# EAGLE design ProbeTK_r1.0 (EAGLE 5.00)
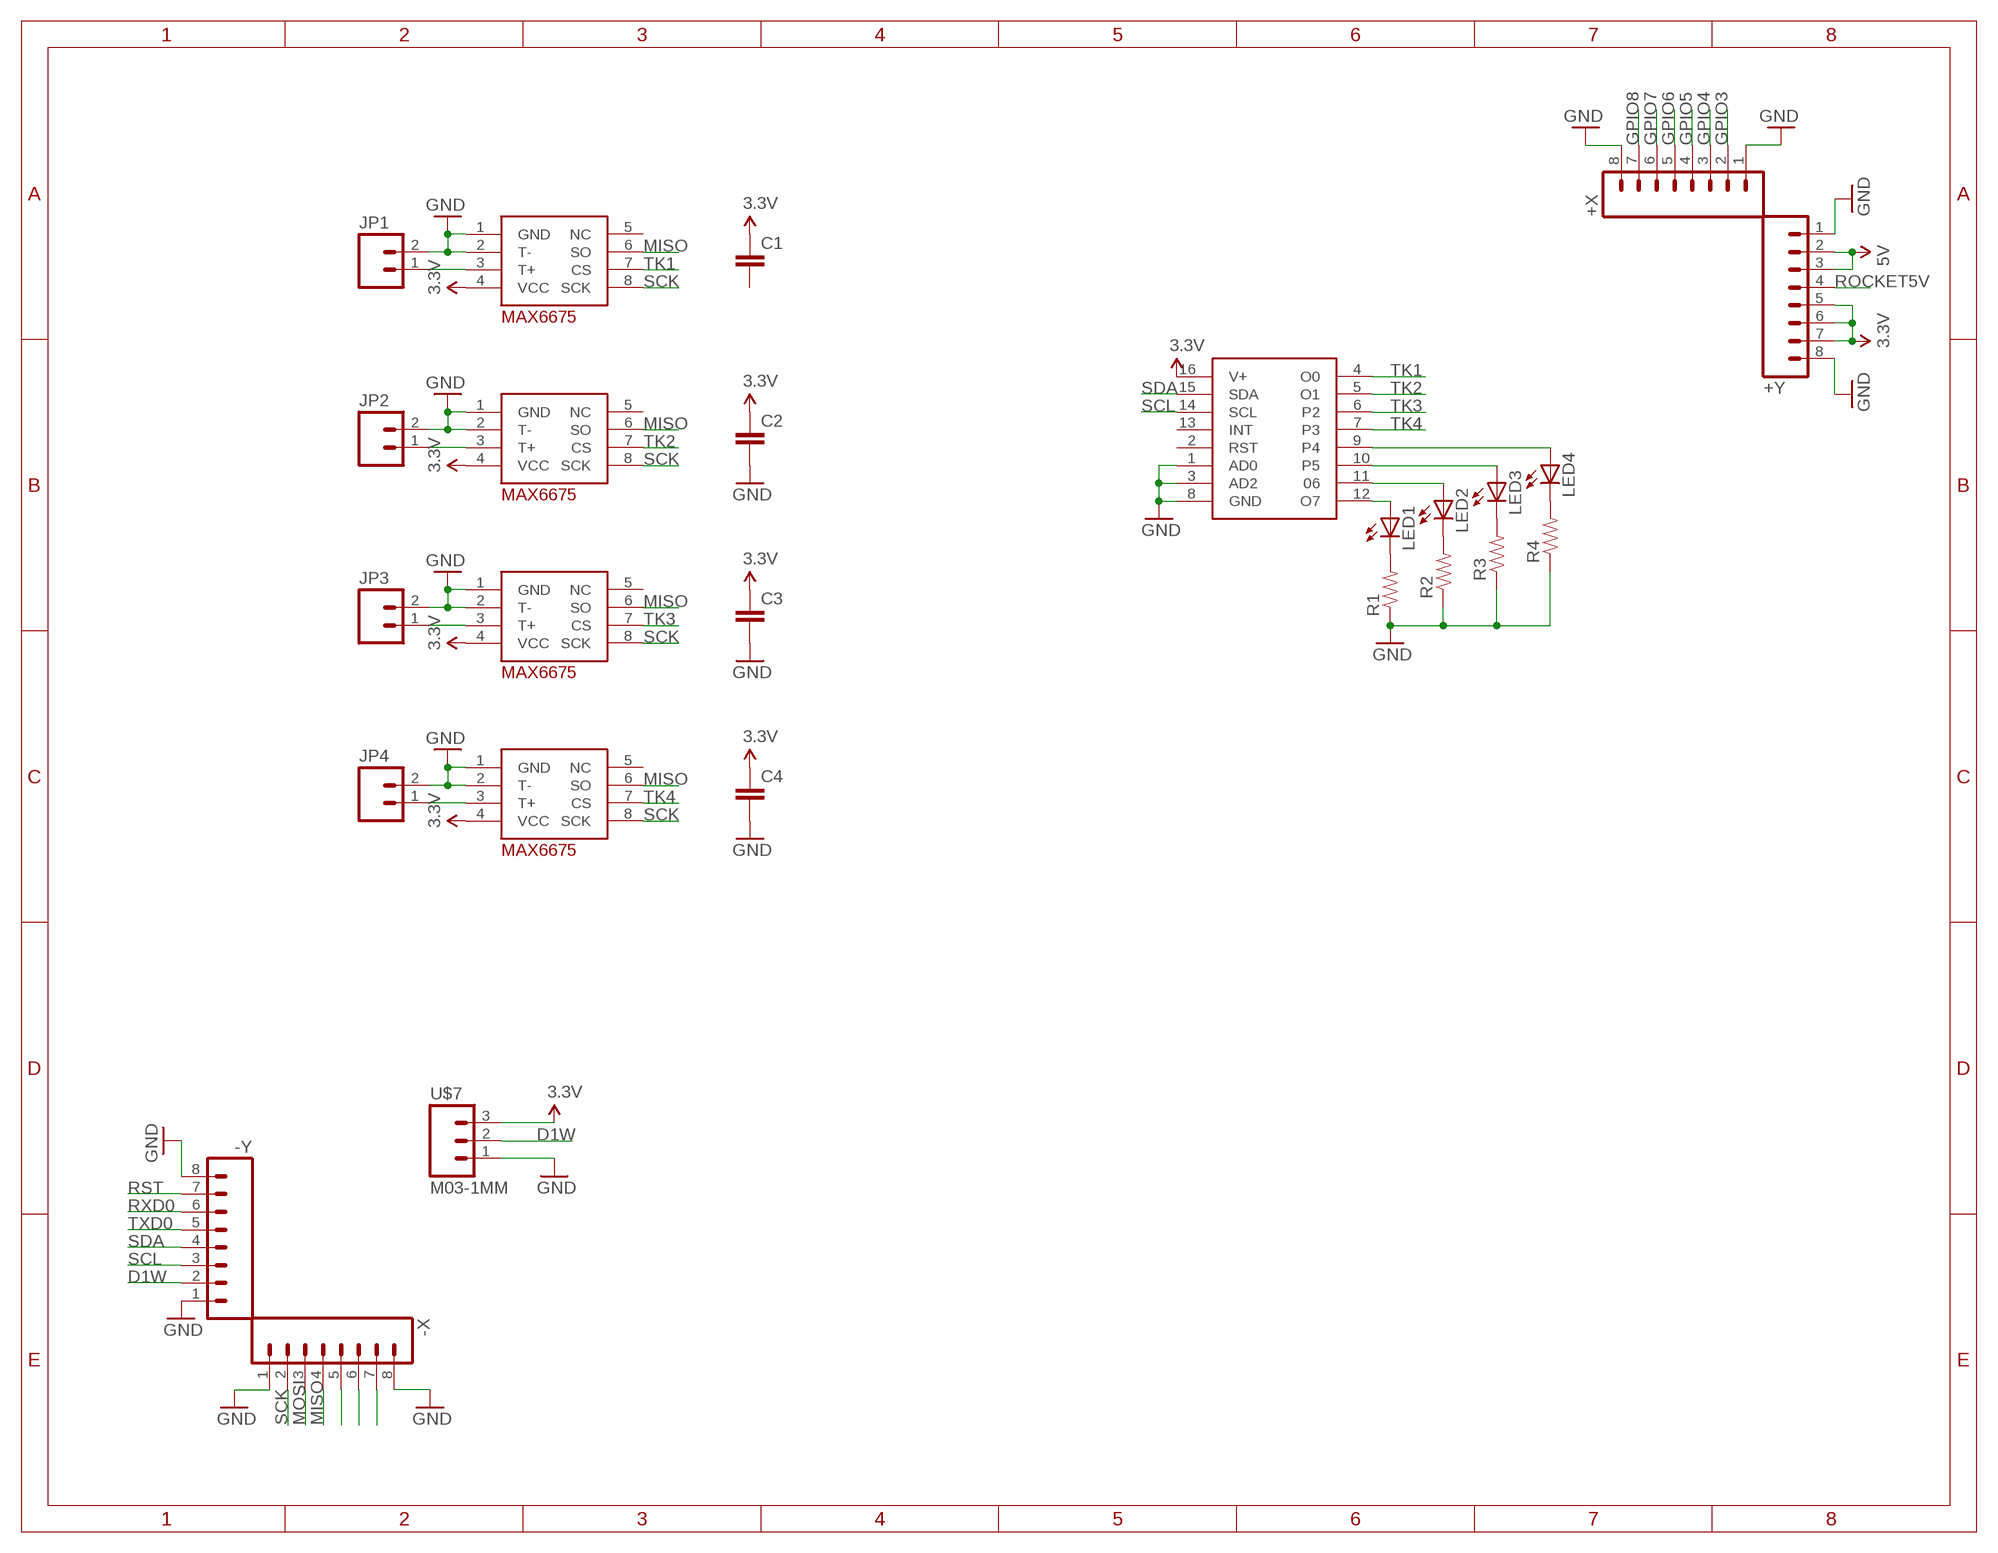
[diagram p0: schematic, sheet 1]

## Parts
+X  M08  [1X08]
+Y  M08  [1X08]
-X  M08  [1X08]
-Y  M08  [1X08]
C1  CAP0805  [0805]
C2  CAP0805  [0805]
C3  CAP0805  [0805]
C4  CAP0805  [0805]
JP1  M02-JST-2MM-SMT  [S2B-PH]
JP2  M02-JST-2MM-SMT  [S2B-PH]
JP3  M02-JST-2MM-SMT  [S2B-PH]
JP4  M02-JST-2MM-SMT  [S2B-PH]
LED1  LEDCHIPLED_0805  [CHIPLED_0805]
LED2  LEDCHIPLED_0805  [CHIPLED_0805]
LED3  LEDCHIPLED_0805  [CHIPLED_0805]
LED4  LEDCHIPLED_0805  [CHIPLED_0805]
R1  RESISTOR  [0805]
R2  RESISTOR  [0805]
R3  RESISTOR  [0805]
R4  RESISTOR  [0805]
U$1  MAX6675  [SO08]
U$3  MAX6675  [SO08]
U$4  MAX6675  [SO08]
U$5  MAX6675  [SO08]
U$6  MAX7323  [QSOP16]
U$7  M03-1MM  [S3B-PH]

## Nets
3.3V: +Y.5 +Y.6 +Y.7 C1.1 C2.1 C3.1 C4.1 U$1.4(VCC) U$3.4(VCC) U$4.4(VCC) U$5.4(VCC) U$6.16(V+) U$7.3
5V: +Y.2 +Y.3
D1W: -Y.2 U$7.2
GND: +X.1 +X.8 +Y.1 +Y.8 -X.1 -X.8 -Y.1 -Y.8 C2.2 C3.2 C4.2 JP1.2 JP2.2 JP3.2 JP4.2 R1.1 R2.1 R3.1 R4.1 U$1.1(GND) U$1.2(T-) U$3.1(GND) U$3.2(T-) U$4.1(GND) U$4.2(T-) U$5.1(GND) U$5.2(T-) U$6.1(AD0) U$6.3(AD2) U$6.8(GND) U$7.1
GPIO0: -X.7
GPIO1: -X.6
GPIO2: -X.5
GPIO3: +X.2
GPIO4: +X.3
GPIO5: +X.4
GPIO6: +X.5
GPIO7: +X.6
GPIO8: +X.7
MISO: -X.4 U$1.6(SO) U$3.6(SO) U$4.6(SO) U$5.6(SO)
MOSI: -X.3
N$1: JP1.1 U$1.3(T+)
N$2: JP2.1 U$3.3(T+)
N$3: JP3.1 U$4.3(T+)
N$4: JP4.1 U$5.3(T+)
N$5: LED1.A U$6.12(O7)
N$6: LED2.A U$6.11
N$7: LED3.A U$6.10(P5)
N$8: LED4.A U$6.9(P4)
N$10: LED1.C R1.2
N$11: LED2.C R2.2
N$12: LED3.C R3.2
N$13: LED4.C R4.2
ROCKET5V: +Y.4
RST: -Y.7
RXD0: -Y.6
SCK: -X.2 U$1.8(SCK) U$3.8(SCK) U$4.8(SCK) U$5.8(SCK)
SCL: -Y.3 U$6.14(SCL)
SDA: -Y.4 U$6.15(SDA)
TK1: U$1.7(CS) U$6.4(O0)
TK2: U$3.7(CS) U$6.5(O1)
TK3: U$4.7(CS) U$6.6(P2)
TK4: U$5.7(CS) U$6.7(P3)
TXD0: -Y.5
Unconnected: C1.2 U$1.5(NC) U$3.5(NC) U$4.5(NC) U$5.5(NC) U$6.2(RST) U$6.13(INT)

## Library data of the parts
+X +Y -X -Y = SparkFun:M08: Header 8 Standard 8-pin 0.1" header. Use with straight break away headers (SKU : PRT-00116), right angle break away headers (PRT-00553), swiss pins (PRT-00743), machine pins (PRT-00117), and female headers (PRT-00115).
C1-C4 = SparkFun:CAP: Capacitor Standard 0603 ceramic capacitor, and 0.1" leaded capacitor.
JP1-JP4 = SparkFun:M02: Header 2 Standard 2-pin 0.1" header. Use with straight break away headers (SKU : PRT-00116), right angle break away headers (PRT-00553), swiss pins (PRT-00743), machine pins (PRT-00117), and female headers (PRT-00115). Molex polarized connector foot print use with SKU : PRT-08233 with associated crimp pins and housings.
LED1-LED4 = led:LED: LED OSRAM: - CHIPLED LG R971, LG N971, LY N971, LG Q971, LY Q971, LO R971, LY R971 LH N974, LH R974 LS Q976, LO Q976, LY Q976 LO Q996 - Hyper CHIPLED LW Q18S LB Q993, LB Q99A, LB R99A - SideLED LS A670, LO A670, LY A670, LG A670, LP A670 LB A673, LV A673, LT A673, LW A673 LH A674 LY A675 LS A676, LA A676, LO A676, LY A676, LW A676 LS A679, LY A679, LG A679 - Hyper Micro SIDELED® LS Y876, LA Y876, LO Y876, LY Y876 LT Y87S - SmartLED LW L88C, LW L88S LB L89C, LB L89S, LG L890 LS L89K, LO L89K, LY L89K LS L896, LA L896, LO L896, LY L896 - TOPLED LS T670, LO T670, LY T670, LG T670, LP T670 LSG T670, LSP T670, LSY T670, LOP T670, LYG T670 LG T671, LOG T671, LSG T671 LB T673, LV T673, LT T673, LW T673 LH T674 LS T676, LA T676, LO T676, LY T676, LB T676, LH T676, LSB T676, LW T676 LB T67C, LV T67C, LT T67C, LS T67K, LO T67K, LY T67K, LW E67C LS E67B, LA E67B, LO E67B, LY E67B, LB E67C, LV E67C, LT E67C LW T67C LS T679, LY T679, LG T679 LS T770, LO T770, LY T770, LG T770, LP T770 LB T773, LV T773, LT T773, LW T773 LH T774 LS E675, LA E675, LY E675, LS T675 LS T776, LA T776, LO T776, LY T776, LB T776 LHGB T686 LT T68C, LB T68C - Hyper Mini TOPLED® LB M676 - Mini TOPLED Santana® LG M470 LS M47K, LO M47K, LY M47K Source: http://www.osram.convergy.de - LUMILED® LXK2-PW12-R00, LXK2-PW12-S00, LXK2-PW14-U00, LXK2-PW14-V00 LXK2-PM12-R00, LXK2-PM12-S00, LXK2-PM14-U00 LXK2-PE12-Q00, LXK2-PE12-R00, LXK2-PE12-S00, LXK2-PE14-T00, LXK2-PE14-U00 LXK2-PB12-K00, LXK2-PB12-L00, LXK2-PB12-M00, LXK2-PB14-N00, LXK2-PB14-P00, LXK2-PB14-Q00 LXK2-PR12-L00, LXK2-PR12-M00, LXK2-PR14-Q00, LXK2-PR14-R00 LXK2-PD12-Q00, LXK2-PD12-R00, LXK2-PD12-S00 LXK2-PH12-R00, LXK2-PH12-S00 LXK2-PL12-P00, LXK2-PL12-Q00, LXK2-PL12-R00 Source: www.luxeon.com
R1-R4 = SparkFun:RESISTOR: Resistor Basic schematic elements and footprints for 0603, 1206, and PTH 1/10th watt (small) resistors.
U$1 U$3-U$5 = maxim:MAX6675
U$6 = maxim:MAX7323
U$7 = SparkFun:M03-1MM

## Board
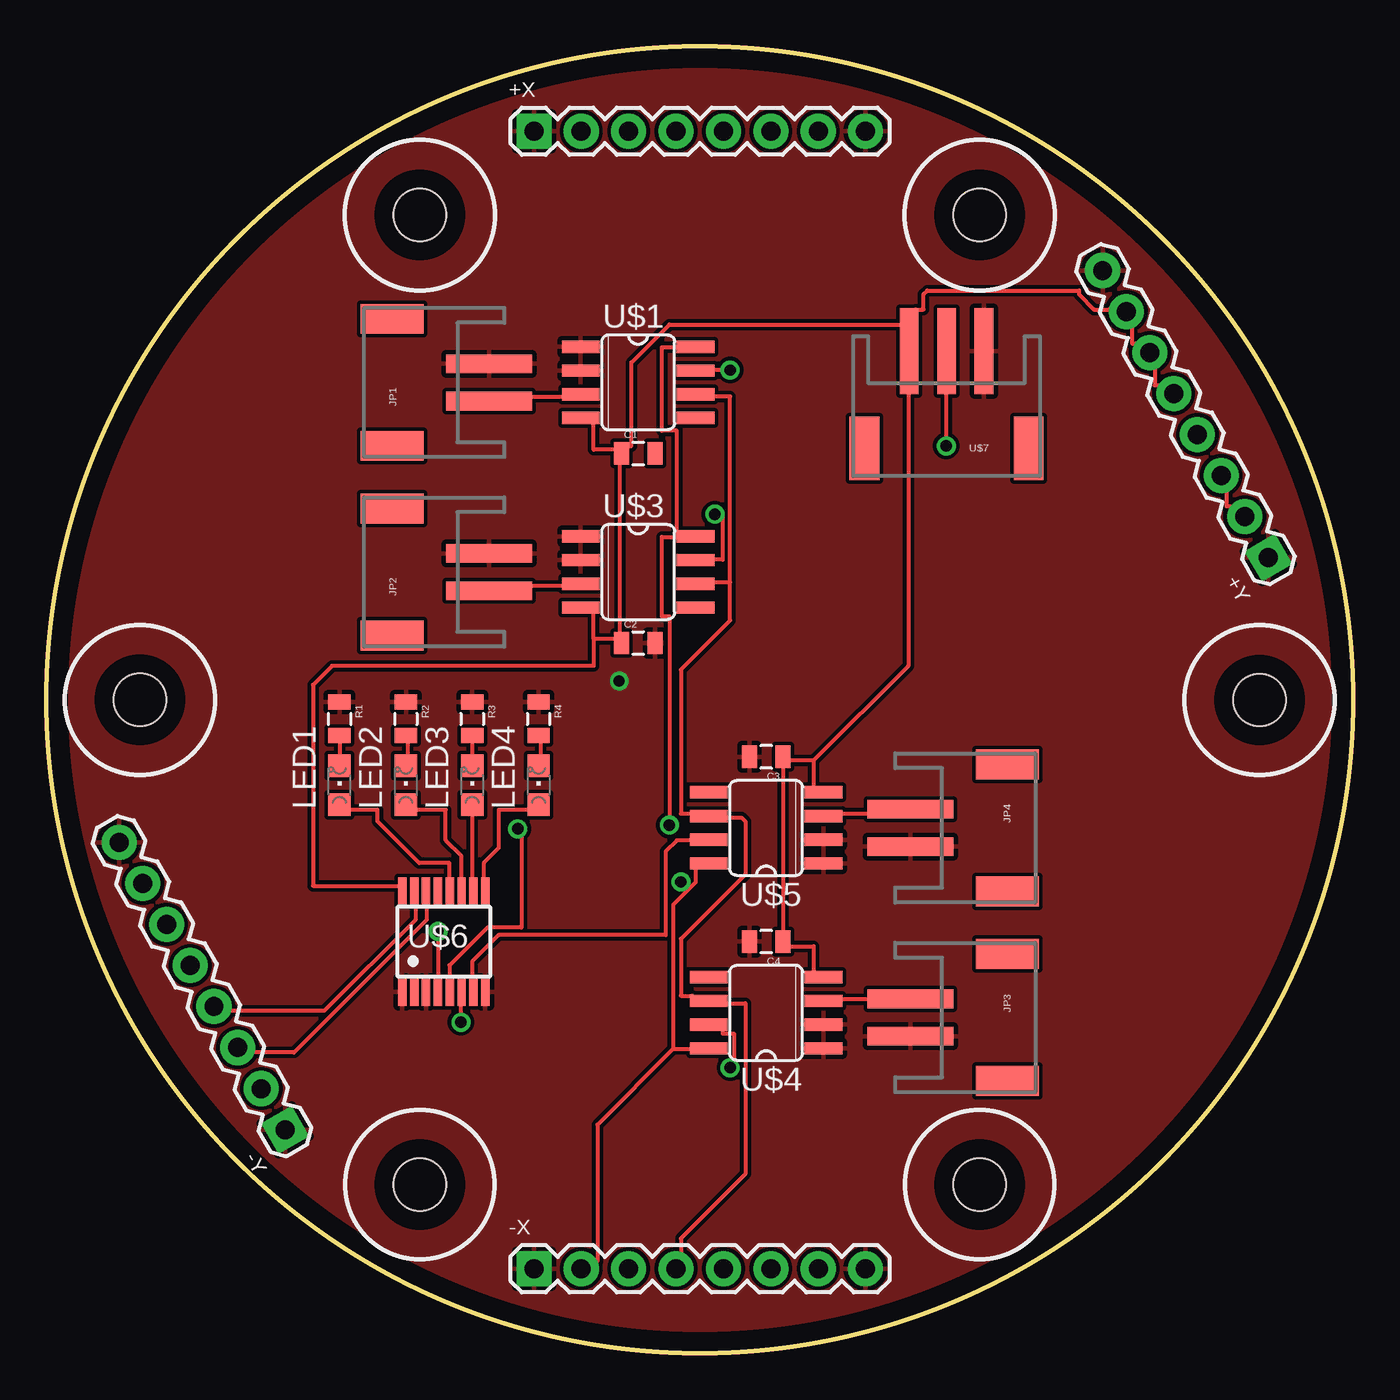
[diagram p1: board, top side]
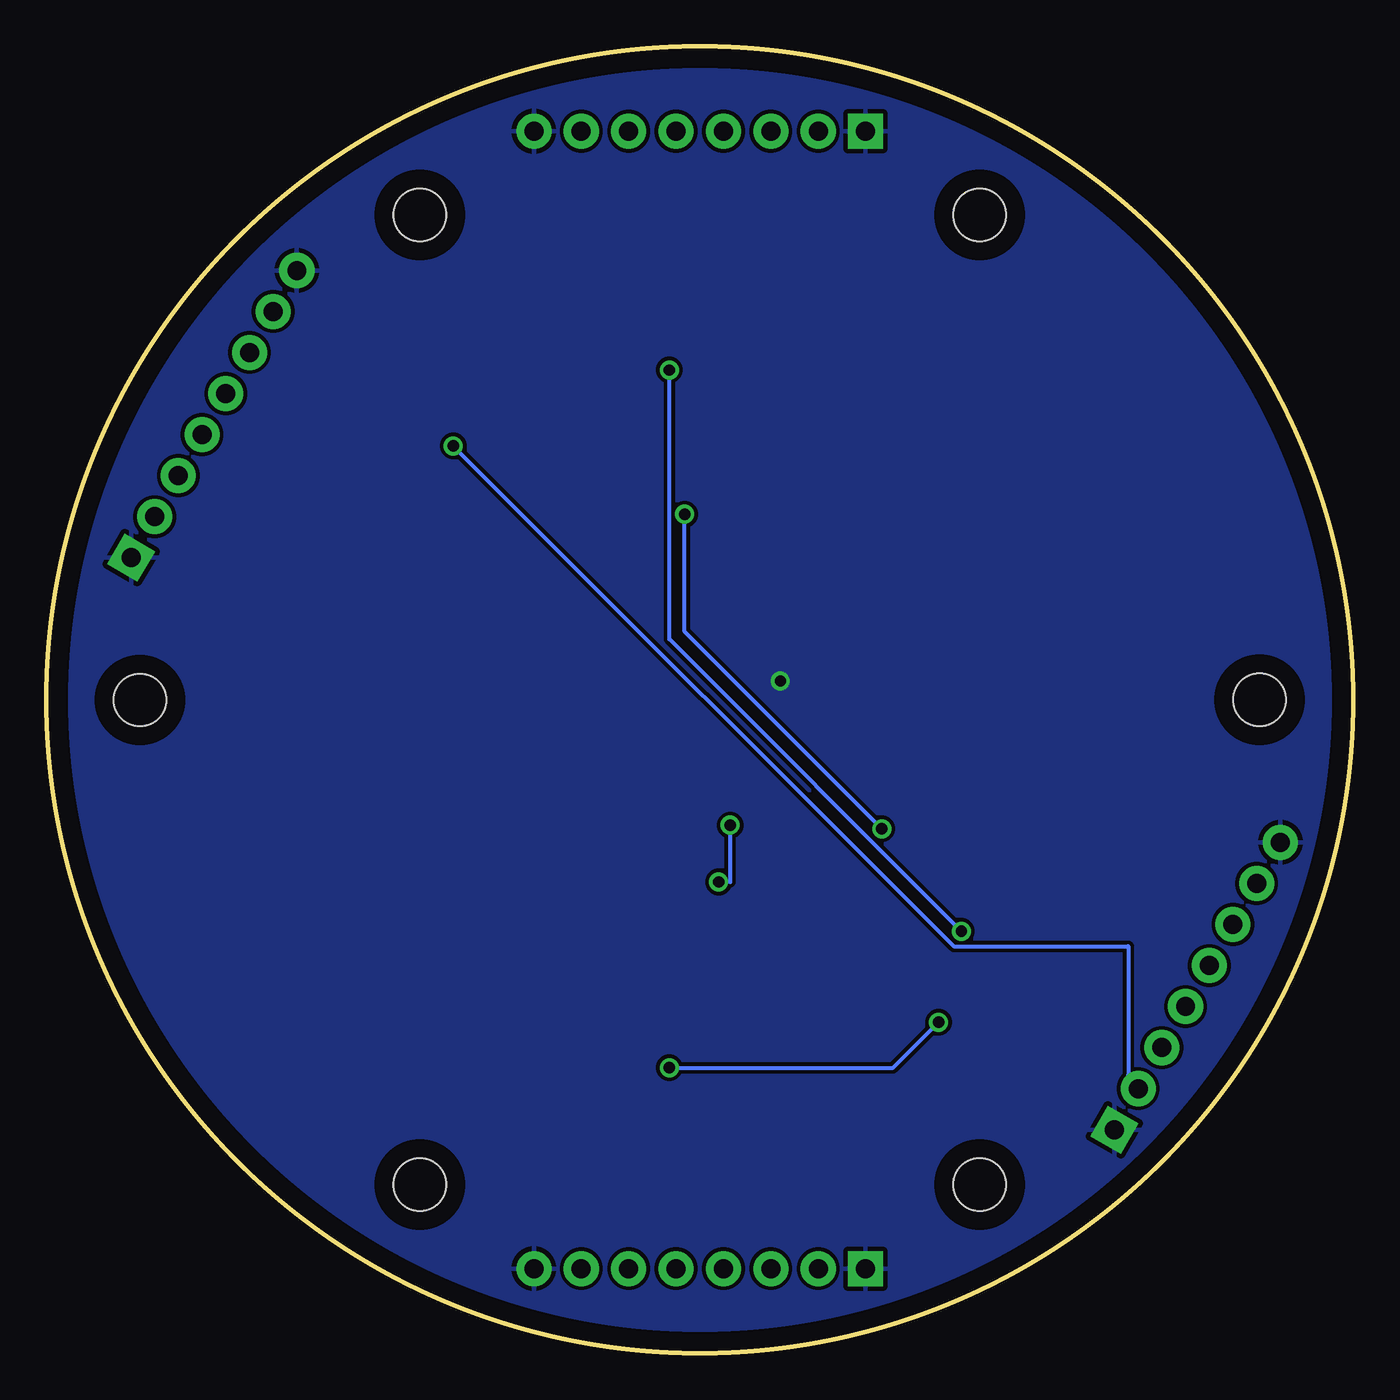
[diagram p2: board, bottom side, seen from below]

Size 70 x 70 mm. Coordinates in mm from the lower left corner, seen from the top.
Outline: circle at 35,35 radius 35
Copper layers (1*16): Top 0.035mm / dielectric 1.5mm / Bottom 0.035mm
Design rules "default *": minimum track width 8mil, minimum drill 24mil, track to track 8mil, track to pad 8mil, pad to pad 8mil, via to via 8mil, smd to smd 8mil, copper to edge 40mil, drill to drill 8mil, minimum pad ring 10mil, minimum via ring 8mil, stop-mask expansion 4mil, vias tented up to drill 0mil, thermal gap 10mil
Holes 2.8 mm at 5,35 65,34.99 50,60.98 50,9.02 20,9.02 20,60.98

### Footprints (pad centres in the part's own frame; a part is rotated, then mirrored left to right if it is on the bottom)
1X08 = drill 1.016 pad 1.88 square: 1 0,0 | drill 1.016 pad 1.88 round: 2 2.54,0; 3 5.08,0; 4 7.62,0; 5 10.16,0; 6 12.7,0; 7 15.24,0; 8 17.78,0
0805 = smd 0.8 x 1.2: 1 -0.9,0; 2 0.9,0
S2B-PH = smd 1 x 4.6: 1 -1,-3.7; 2 1,-3.7 | smd 1.6 x 3.4: NC1 -3.4,1.5; NC2 3.4,1.5
CHIPLED_0805 = smd 1.2 x 1.2: A 0,-1.05; C 0,1.05
SO08 = smd 0.66 x 2.032: 1 -1.905,-3.073; 2 -0.635,-3.073; 3 0.635,-3.073; 4 1.905,-3.073; 5 1.905,3.073; 6 0.635,3.073; 7 -0.635,3.073; 8 -1.905,3.073
QSOP16 = smd 0.45 x 1.5: 1 -2.223,-2.69; 2 -1.587,-2.69; 3 -0.953,-2.69; 4 -0.318,-2.69; 5 0.318,-2.69; 6 0.953,-2.69; 7 1.587,-2.69; 8 2.223,-2.69; 9 2.223,2.69; 10 1.587,2.69; 11 0.953,2.69; 12 0.318,2.69; 13 -0.318,2.69; 14 -0.953,2.69; 15 -1.587,2.69; 16 -2.223,2.69
S3B-PH = smd 1 x 4.6: 1 -1,-3.192; 2 1,-3.192; 3 3,-3.192 | smd 1.6 x 3.4: NC1 -3.4,2.008; NC2 5.4,2.008

### Placement (x,y rotation side)
+X  26.11,65.47 0 top
+Y  65.48,42.61 120 top
-X  26.11,4.51 0 top
-Y  12.77,11.96 120 top
C1  31.7,48.2 0 top
C2  31.7,38.04 0 top
C3  38.56,31.94 180 top
C4  38.56,22.04 180 top
JP1  20.01,52.01 90 top
JP2  20.01,41.85 90 top
JP3  49.99,17.97 270 top
JP4  49.99,28.13 270 top
LED1  15.7,30.42 0 top
LED2  19.25,30.42 0 top
LED3  22.81,30.42 0 top
LED4  26.36,30.42 0 top
R1  15.7,33.97 270 top
R2  19.25,33.97 270 top
R3  22.81,33.97 270 top
R4  26.36,33.97 270 top
U$1  31.7,52.01 270 top
U$3  31.7,41.85 270 top
U$4  38.56,18.23 90 top
U$5  38.56,28.13 90 top
U$6  21.28,22.04 0 top
U$7  49.22,50.48 180 top

### Tracks (layer width: path | path; a pad name or v marks a point on that pad's centre or on a via)
3.3V
  Top 0.203: C1.1 30.53,48.4 29.31,48.4 29.31,49.82 U$1.4 | 29.31,38.24 30.53,38.24 C2.1 30.73,38.44 30.73,47.79 C1.1 | 29.31,38.24 29.31,39.66 U$3.4 | 29.31,38.24 29.31,36.82 15.29,36.82 14.27,35.8 14.27,25.03 18.95,25.03 U$6.16 | U$4.4 41.1,20.36 41.1,21.78 39.67,21.78 C4.1 39.47,22.6 39.47,31.54 C3.1 39.67,31.74 41.1,31.74 | 41.1,31.74 41.1,30.32 U$5.4 | +Y.5 59.59,51.86 59.38,51.86 59.38,52.87 +Y.6 58.37,54.09 58.16,54.09 58.16,54.9 +Y.7 56.95,55.92 56.13,55.92 55.32,56.73 55.32,56.94 47.19,56.94 46.99,56.73 46.99,55.92 46.58,55.92 U$7.3 | 41.1,31.74 46.18,36.82 46.18,51.45 U$7.3 | C1.1 31.14,48.6 31.34,48.6 31.34,53.08 33.37,55.11 45.77,55.11 U$7.3
5V
  Top 0.203: +Y.2 63.45,45.35 63.25,45.35 63.25,46.17 +Y.3
D1W  (via drill 0.61)
  Top 0.203: v48.21,48.6 48.21,51.45 U$7.2
  Bottom 0.203: v48.21,48.6 21.39,21.78 12.04,21.78 12.04,14.87 -Y.2
GND  (via drill 0.6)
  other vias: 30.68,36.01
  pour Top: -0.31,70.3 -0.31,-0.32 70.31,-0.32 70.31,70.3
  pour Bottom: -0.31,70.3 -0.31,-0.32 70.31,-0.32 70.31,70.3
MISO
  Top 0.203: -X.4 33.98,5.32 33.98,6.14 37.44,9.59 37.44,18.73 36.42,18.73 U$4.6 34.59,19.14 33.98,19.14 33.98,22.19 37.44,25.64 37.44,28.49 37.23,28.69 36.42,28.69 U$5.6 34.59,28.89 33.98,28.89 33.98,36.62 36.63,39.26 36.63,41.29 | 36.63,41.29 35.61,41.29 U$3.6 | 36.63,41.29 36.63,51.25 35.61,51.25 U$1.6
N$1
  Top 0.203: U$1.3 27.68,51.25 25.86,51.25 JP1.1
N$2
  Top 0.203: U$3.3 27.68,41.09 25.86,41.09 JP2.1
N$3
  Top 0.203: U$4.3 42.52,18.94 44.14,18.94 JP3.1
N$4
  Top 0.203: U$5.3 42.52,28.89 44.14,28.89 JP4.1
N$5
  Top 0.203: LED1.A 16.1,29.1 17.73,29.1 17.73,28.49 19.96,26.25 21.59,26.25 21.59,25.44 U$6.12
N$6
  Top 0.203: LED2.A 19.76,29.1 21.39,29.1 21.39,27.47 22.2,26.66 22.2,25.44 U$6.11
N$7
  Top 0.203: LED3.A 22.81,25.44 U$6.10
N$8
  Top 0.203: LED4.A 25.86,29.1 24.23,29.1 24.23,27.07 23.42,26.25 23.42,25.44 U$6.9
N$10
  Top 0.203: R1.2 LED1.C
N$11
  Top 0.203: LED2.C 19.35,31.94 19.35,32.76 R2.2
N$12
  Top 0.203: R3.2 LED3.C
N$13
  Top 0.203: LED4.C 26.47,31.94 26.47,32.76 R4.2
SCK  (via drill 0.61)
  Top 0.203: U$1.8 33.78,53.89 32.97,53.89 32.97,49.42 33.78,49.42 33.78,43.93 U$3.8 33.78,43.73 32.97,43.73 32.97,39.46 33.37,39.46 v33.37,28.28 | 33.58,16.3 34.59,16.3 U$4.8 | 33.58,16.3 33.58,24.02 34.39,24.83 | 34.39,24.83 34.8,25.24 34.8,26.05 U$5.8 | 33.58,16.3 29.51,12.23 29.51,4.92 -X.2 | v33.98,25.24 34.39,24.83
  Bottom 0.203: v33.37,28.28 33.37,25.24 v33.98,25.24
SCL
  Top 0.203: U$6.14 20.37,24.02 20.37,23.2 13.26,16.09 11.02,16.09 -Y.3
SDA
  Top 0.203: U$6.15 19.76,24.02 19.76,23.2 14.88,18.33 9.8,18.33 -Y.4
TK1  (via drill 0.61)
  Top 0.203: v20.98,22.6 20.98,19.95 U$6.4 | v36.63,52.67 35.61,52.67 U$1.7
  Bottom 0.203: v20.98,22.6 36.63,38.24 v36.63,52.67
TK2  (via drill 0.61)
  Top 0.203: v25.25,28.08 25.45,27.88 25.45,22.8 23.62,22.8 21.59,20.77 21.59,19.95 U$6.5 | v35.81,44.95 36.22,44.95 36.22,42.51 35.61,42.51 U$3.7
  Bottom 0.203: v25.25,28.08 35.81,38.65 v35.81,44.95
TK3  (via drill 0.61)
  Top 0.203: v22.2,17.72 22.2,18.73 U$6.6 | v36.63,15.28 36.83,15.28 36.83,17.11 36.22,17.11 36.22,17.31 U$4.7
  Bottom 0.203: v22.2,17.72 24.64,15.28 v36.63,15.28
TK4
  Top 0.203: U$6.7 22.81,19.95 22.81,20.97 24.23,22.39 33.17,22.39 33.17,26.86 33.78,27.47 34.59,27.47 U$5.7